# Altium schematic sheet [05].HMS.HMI.SchDoc
size A4; SheetNumber: 6; SheetTotal: 7
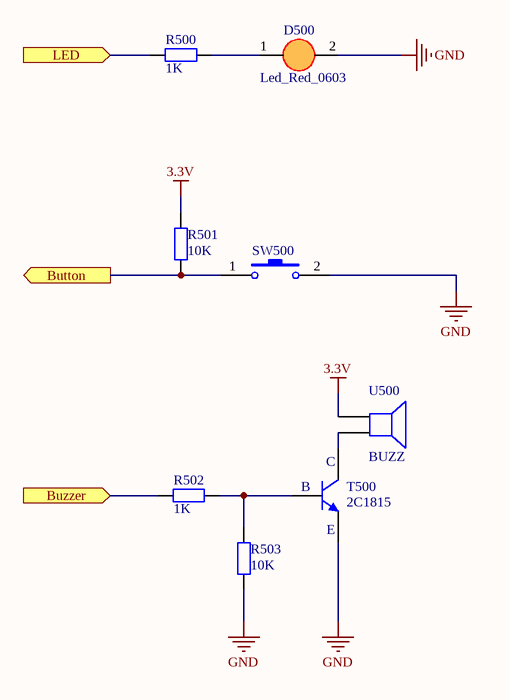
[diagram p0: [05].HMS.HMI.SchDoc]

## Parts
D500  Led_Red_0603  [LED_0603_RED]
R500  1K  [RES_0402(1005)]
R501  10K  [RES_0402(1005)]
R502  1K  [RES_0402(1005)]
R503  10K  [RES_0402(1005)]
SW500  SW-4P-S  [SW 2P 90 Dgerees]  (value not drawn)
T500  2C1815  [SOT23-3]
U500  BUZZ  [BUZZER_THROUGH_5MM]

## Ports
Button (out), Buzzer (in), LED (in)

## Nets
3.3V: R501.2 U500.1
GND: D500.2(K) R503.1 SW500.2 T500.2
Button: R501.1 SW500.1 ; port Button
Buzzer: R502.1 ; port Buzzer
LED: R500.1 ; port LED
NetD500_1: D500.1(A) R500.2
NetR502_2: R502.2 R503.2 T500.1
NetT500_3: T500.3 U500.2

## Notes on the sheet
- (in symbol C18C5) C; B; E

## Library data of the parts
D500 = LED_3MM: LED RED CLEAR CHIP SMD 0603; MFR: LinhKienChatLuong; Value: NCD0603R1; Category: LED; MPN: NCD0603R1
R500 = RC0402FR-071KL: RES 1K OHM 1% 1/8W 0402; MFR: YAGEO; Value: 1K; Category: Chip Resistor - Surface Mount; MPN: RC0402FR-071KL
R501 = RC0402FR-071KL: RES 10K OHM 5% 1/8W 0402; MPN: RC0402JR-0710KL; MFR: YAGEO; Value: 10K; Category: Chip Resistor - Surface Mount
R502 = RC0402FR-131KL: RES 1K OHM 1% 1/16W 0402; MFR: YAGEO; Value: 1K; Category: Chip Resistor - Surface Mount; MPN: RC0402FR-131KL
R503 = RC0402JR-074K7P: RES SMD 10K OHM 5% 1/16W 0402; MFR: YAGEO; ValueNC: NC; Category: Chip Resistor - Surface Mount; MPN: RC0402JR-074K7P; Value: 10K
SW500 = SW-2PIN-SMALL: Switch Small 4 Pin DIP; MPN: Button 4P 6x6x6mm nghiêng; Published: 24-Mar-1999; LatestRevisionDate: 17-Jul-2002; LatestRevisionNote: Re-released for DXP Platform.; PackageReference: SPST-2; Publisher: Altium Limited
T500 = C18C5: D882 2SD882 NPN Transistor 3A 30V SOT-89; MFR: JCET; Value: 30V - 3A; MPN: 2SD882; Category: Transistor NPN
U500 = Speaker: Buzz TMB09A03 3V 9x5.5mm; BAPartNumber: VT-0; Solder: WAVE; Published: 24-Mar-1999; LatestRevisionDate: 17-Jul-2002; LatestRevisionNote: Re-released for DXP Platform.; PackageReference: PIN2; Publisher: Altium Limited; MPN: TMB09A03; Value: BUZZ; Parameter 1: *